# EAGLE design untitled (EAGLE 9.6.2)
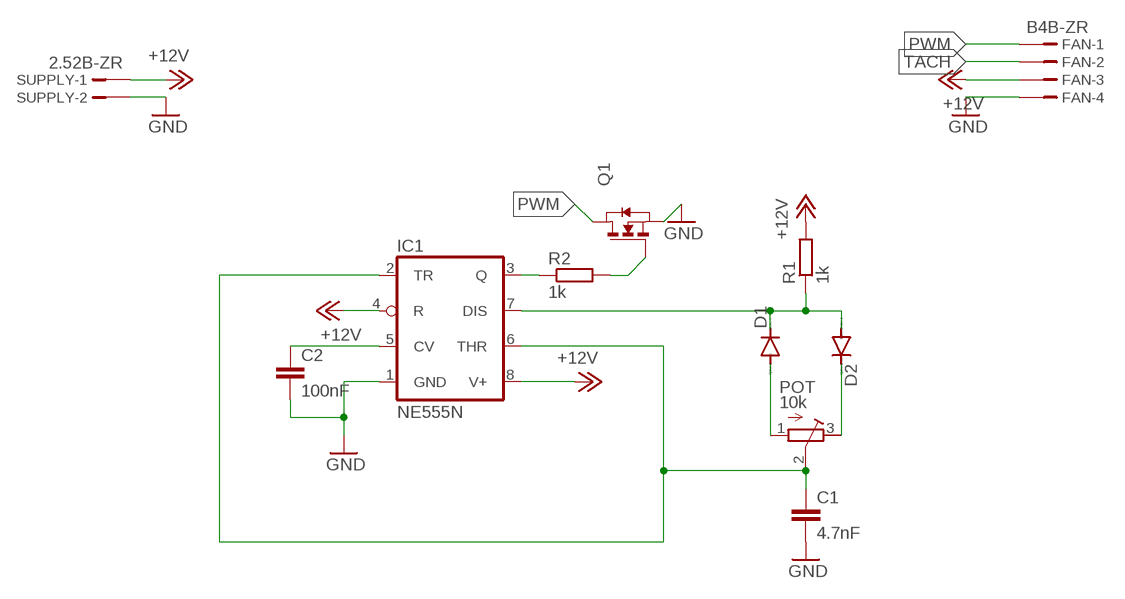
[diagram p0: schematic, sheet 1]

## Parts
C1  4.7nF  C-EU050-030X075  [C050-030X075]
C2  100nF  C-EU025-025X050  [C025-025X050]
D1  CGRM4001-G  [SOD-123_MINI-SMA]
D2  CGRM4001-G  [SOD-123_MINI-SMA]
FAN  B4B-ZR  [B4B-ZR]
IC1  NE555N  [DIL08]
POT  10k  R-TRIMM3296W  [RTRIM3296W]
Q1  NMOSSOT23  [SOT-23]
R1  1k  R-EU_R0603  [R0603]
R2  1k  R-EU_R0603  [R0603]
SUPPLY  2.52B-ZR  [B2B-ZR2.5]

## Nets
+12V: FAN.3 IC1.4(R) IC1.8(V+) R1.2 SUPPLY.1
CV: C2.1 IC1.5(CV)
DIS: D1.C D2.A IC1.7(DIS) R1.1
GND: C1.2 C2.2 FAN.4 IC1.1(GND) Q1.2(S) SUPPLY.2
N$1: Q1.3(G) R2.2
N$4: D1.A POT.1(A)
N$5: D2.C POT.3(E)
PWM: FAN.1 Q1.1(D)
Q: IC1.3(Q) R2.1
TACH: FAN.2
TR: C1.1 IC1.2(TR) IC1.6(THR) POT.2(S)

## Library data of the parts
C1 C2 = rcl-custom:C-EU: CAPACITOR, European symbol; SPICEPREFIX: C
D1 D2 = diode-custom:CGRM400*-G: Molded plasitc,JEDEC SOD-123/Mini SMA Source: Comchip CGRM4001-G.pdf
FAN = con-jst-custom:?4B-ZR: ZH CONNECTOR 1.5 mm, 4 pin 1 row Source: http://www.jst.com .. eZH.pdf; MF: FARNELL; MPN: B4B-ZR(LF)(SN); OC_FARNELL: 1830916; OC_NEWARK: 37K9960
IC1 = linear:*555: TIMER
POT = rcl-custom:R-TRIMM: Trimm resistor; SPICEMODEL: X; SPICEPREFIXL: POT
Q1 = zetex:NMOSSOT23: MOS FET; OC_FARNELL: unknown; OC_NEWARK: unknown
R1 R2 = rcl-custom:R-EU_: RESISTOR, European symbol; SPICEPREFIX: R
SUPPLY = con-jst-custom:?2B-ZR: ZH CONNECTOR 1.5 mm, 4 pin 1 row Source: http://www.jst.com .. eZH.pdf

## Board
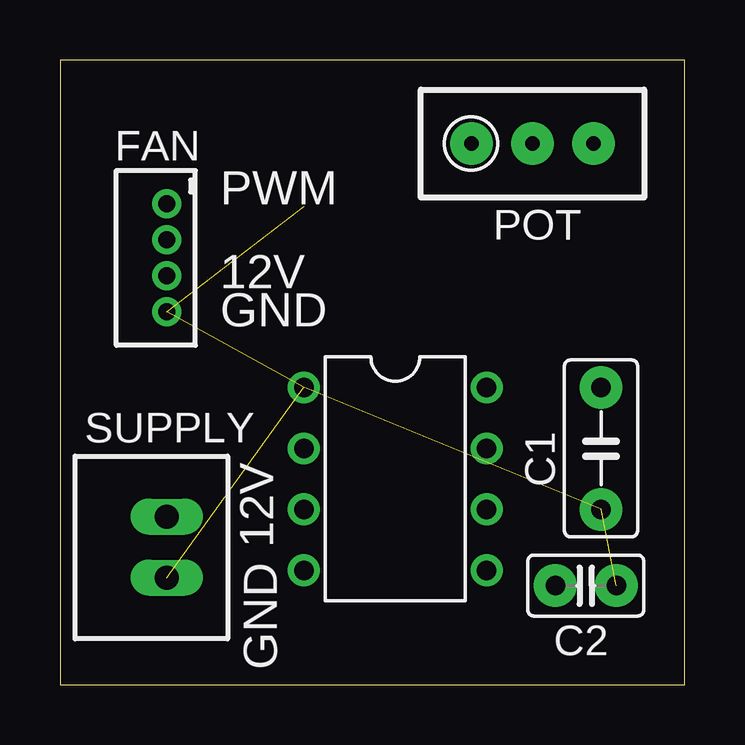
[diagram p1: board, top side]
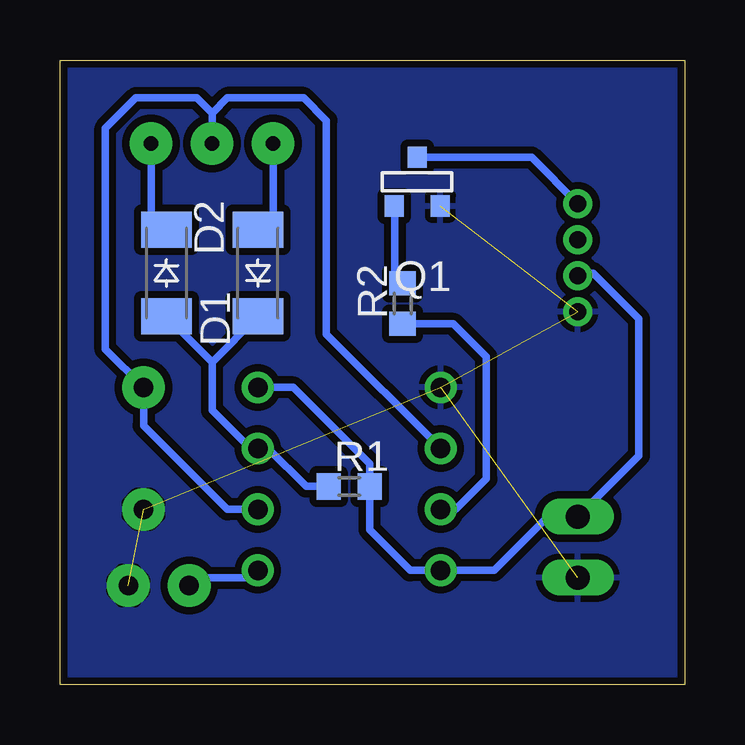
[diagram p2: board, bottom side, seen from below]

Size 26.02 x 26.02 mm. Coordinates in mm from the lower left corner, seen from the top.
Outline: 0,0 26.02,0 26.02,26.02 0,26.02 0,0
Copper layers (1*16): Top 0.035mm / dielectric 1.5mm / Bottom 0.035mm
Design rules "home-made-pcb *": minimum track width 8mil, minimum drill 0.3mm, track to track 12mil, track to pad 8mil, pad to pad 10mil, via to via 10mil, smd to smd 6mil, copper to edge 8mil, drill to drill 10mil, minimum pad ring 10mil, minimum via ring 20mil, stop-mask expansion 4mil, vias tented up to drill 0mil, thermal gap 10mil

### Footprints (pad centres in the part's own frame; a part is rotated, then mirrored left to right if it is on the bottom)
C050-030X075 = drill 0.813 octagon: 1 -2.54,0; 2 2.54,0
C025-025X050 = drill 0.813 octagon: 1 -1.27,0; 2 1.27,0
SOD-123_MINI-SMA = smd 1.5 x 2.1: A 1.8,0; C -1.8,0
B4B-ZR = drill 0.7 pad 1.1: 1 -2.25,0; 2 -0.75,0; 3 0.75,0; 4 2.25,0
DIL08 = drill 0.813 pad 1.27: 1 -3.81,-3.81; 2 -1.27,-3.81; 3 1.27,-3.81; 4 3.81,-3.81; 5 3.81,3.81; 6 1.27,3.81; 7 -1.27,3.81; 8 -3.81,3.81
RTRIM3296W = drill 0.61: 1 0,-2.54; 2 0,0; 3 0,2.54
SOT-23 = smd 0.787 x 0.889: 1 0.025,-1.016; 2 -0.94,1.016; 3 0.991,1.016
R0603 = smd 1 x 1.1: 1 -0.85,0; 2 0.85,0
B2B-ZR2.5 = drill 1 pad 1.422 long: 1 -1.285,0; 2 1.257,0

### Placement (x,y rotation side)
C1  22.54,9.84 270 top
C2  21.91,4.13 0 top
D1  17.78,17.14 90 bottom
D2  21.59,17.14 270 bottom
FAN  4.45,17.78 270 top
IC1  13.97,8.57 270 top
POT  19.68,22.54 270 top
Q1  11.11,20.95 180 bottom
R1  13.97,8.26 0 bottom
R2  11.75,15.88 90 bottom
SUPPLY  4.45,5.71 270 top

### Tracks (layer width: path | path; a pad name or v marks a point on that pad's centre or on a via)
+12V
  Bottom 0.305: FAN.3 4.33,17.14 3.81,17.14 1.91,15.24 1.91,9.54 SUPPLY.1 5.7,7 7.94,4.76 IC1.4 11.43,4.76 13.12,6.45 R1.2 13.12,9.21 16.3,12.38 IC1.8
CV  (via drill 0.45 pad 1.78)
  Bottom 0.305: IC1.5 18.1,4.45 20.32,4.45 C2.1
  other vias: 20.64,4.13
DIS
  Bottom 0.305: R1.1 15.77,8.26 17.36,9.84 IC1.7 18.1,9.84 19.68,11.43 19.68,13.44 | 19.68,13.44 D2.A | D1.C 19.68,13.44
GND  (via drill 0.45 pad 1.78)  (5 unrouted)
  other vias: 23.18,4.13 22.54,7.3
  pour Bottom (isolate 0.305): -0.64,-0.64 27.94,-0.64 27.94,26.67 -0.64,26.67
  pour Bottom (isolate 0.305): -1.27,-1.27 28.57,-1.27 28.57,27.3 -1.27,27.3
N$1
  Bottom 0.305: Q1.3 12.06,19.9 12.06,17.04 R2.2
N$4  (via drill 0.45 pad 1.78)
  Bottom 0.305: POT.1 17.14,19.58 D1.A
  other vias: 17.14,22.54
N$5  (via drill 0.45 pad 1.78)
  Bottom 0.305: v22.23,22.54 22.23,19.58 D2.C
PWM
  Bottom 0.305: Q1.1 6.38,21.97 4.45,20.04 FAN.1
Q
  Bottom 0.305: IC1.3 9.53,7.3 8.26,8.57 8.26,13.65 9.63,15.03 R2.1
TR  (via drill 0.45 pad 1.78)
  Bottom 0.305: IC1.6 19.05,7.3 22.54,10.79 C1.1 24.13,13.97 24.13,23.18 22.86,24.45 20.32,24.45 19.68,23.81 | 19.68,23.81 19.05,24.45 15.88,24.45 14.92,23.5 14.92,14.61 IC1.2 | 19.68,23.81 POT.2
  other vias: 19.68,22.54 22.54,12.38

### Text on the board
tNames: PWM | 12V | GND | 12V | GND